# Altium project MAX30102_Adapter.PrjPcb
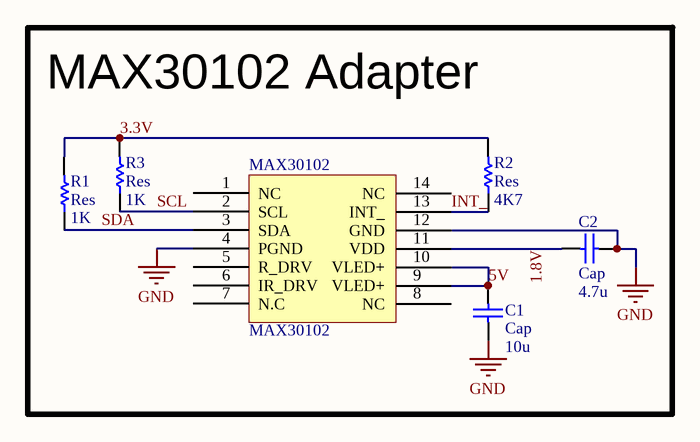
[diagram p0: MAX30102_Adapter_SCH.SchDoc]
1 sheet, 6 parts. Net scope: global (net labels, ports and power ports of the same name join across sheets).
Board file: MAX30102_Adapter_PCB.PcbDoc

## Sheet MAX30102_Adapter_SCH.SchDoc
size A4

### Parts
C1  Cap  value 10u  [0603 Cap]
C2  Cap  value 4.7u  [0603 Cap]
MAX30102  MAX30102  [MAX30102]
R1  Res  value 1K  [0603 Res]
R2  Res  value 4K7  [0603 Res]
R3  Res  value 1K  [0603 Res]

### Blocks framed on the sheet
MAX30102 Adapter: C1 C2 MAX30102 R1-R3

### Nets
GND: C1.2 C2.1 MAX30102.4(PGND) MAX30102.12(GND)
1.8V: C2.2 MAX30102.11(VDD)
3.3V: R1.2 R2.2 R3.2
5V: C1.1 MAX30102.9(VLED+) MAX30102.10(VLED+)
INT_: MAX30102.13(INT_) R2.1
SCL: MAX30102.2(SCL) R3.1
SDA: MAX30102.3(SDA) R1.1

Not connected (* = marked no-connect by the designer): MAX30102 1(NC) 5(R_DRV) 6(IR_DRV) 7(N.C) 8(NC) 14(NC)